# EAGLE design KAnggara75 (EAGLE 9.6.2)
Kiki
DATE: 24/01/2020

## Sheet 1 of 3: ESP32 + PowerS
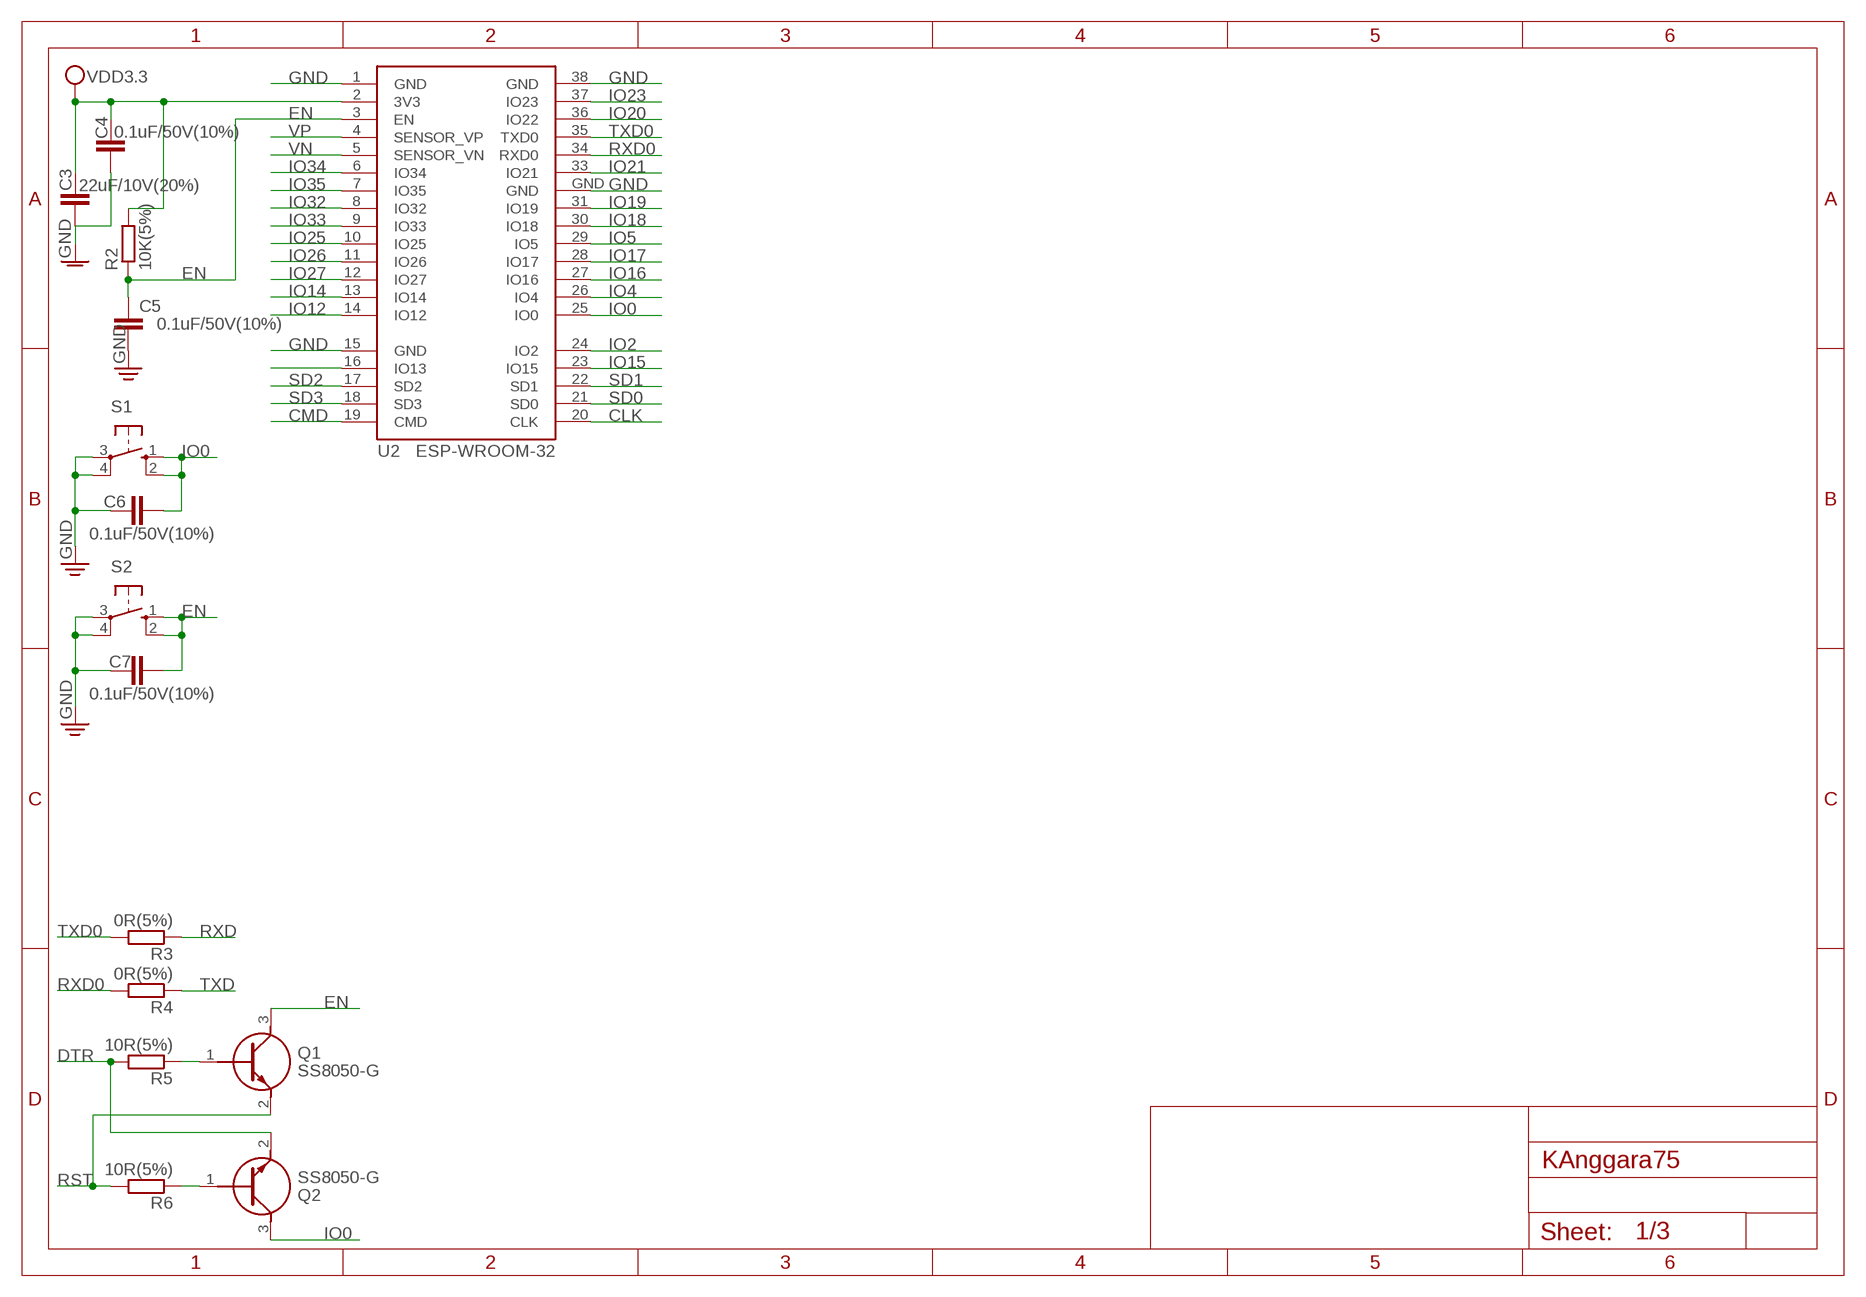
[diagram p0: schematic, sheet 1, part 1 of 2]
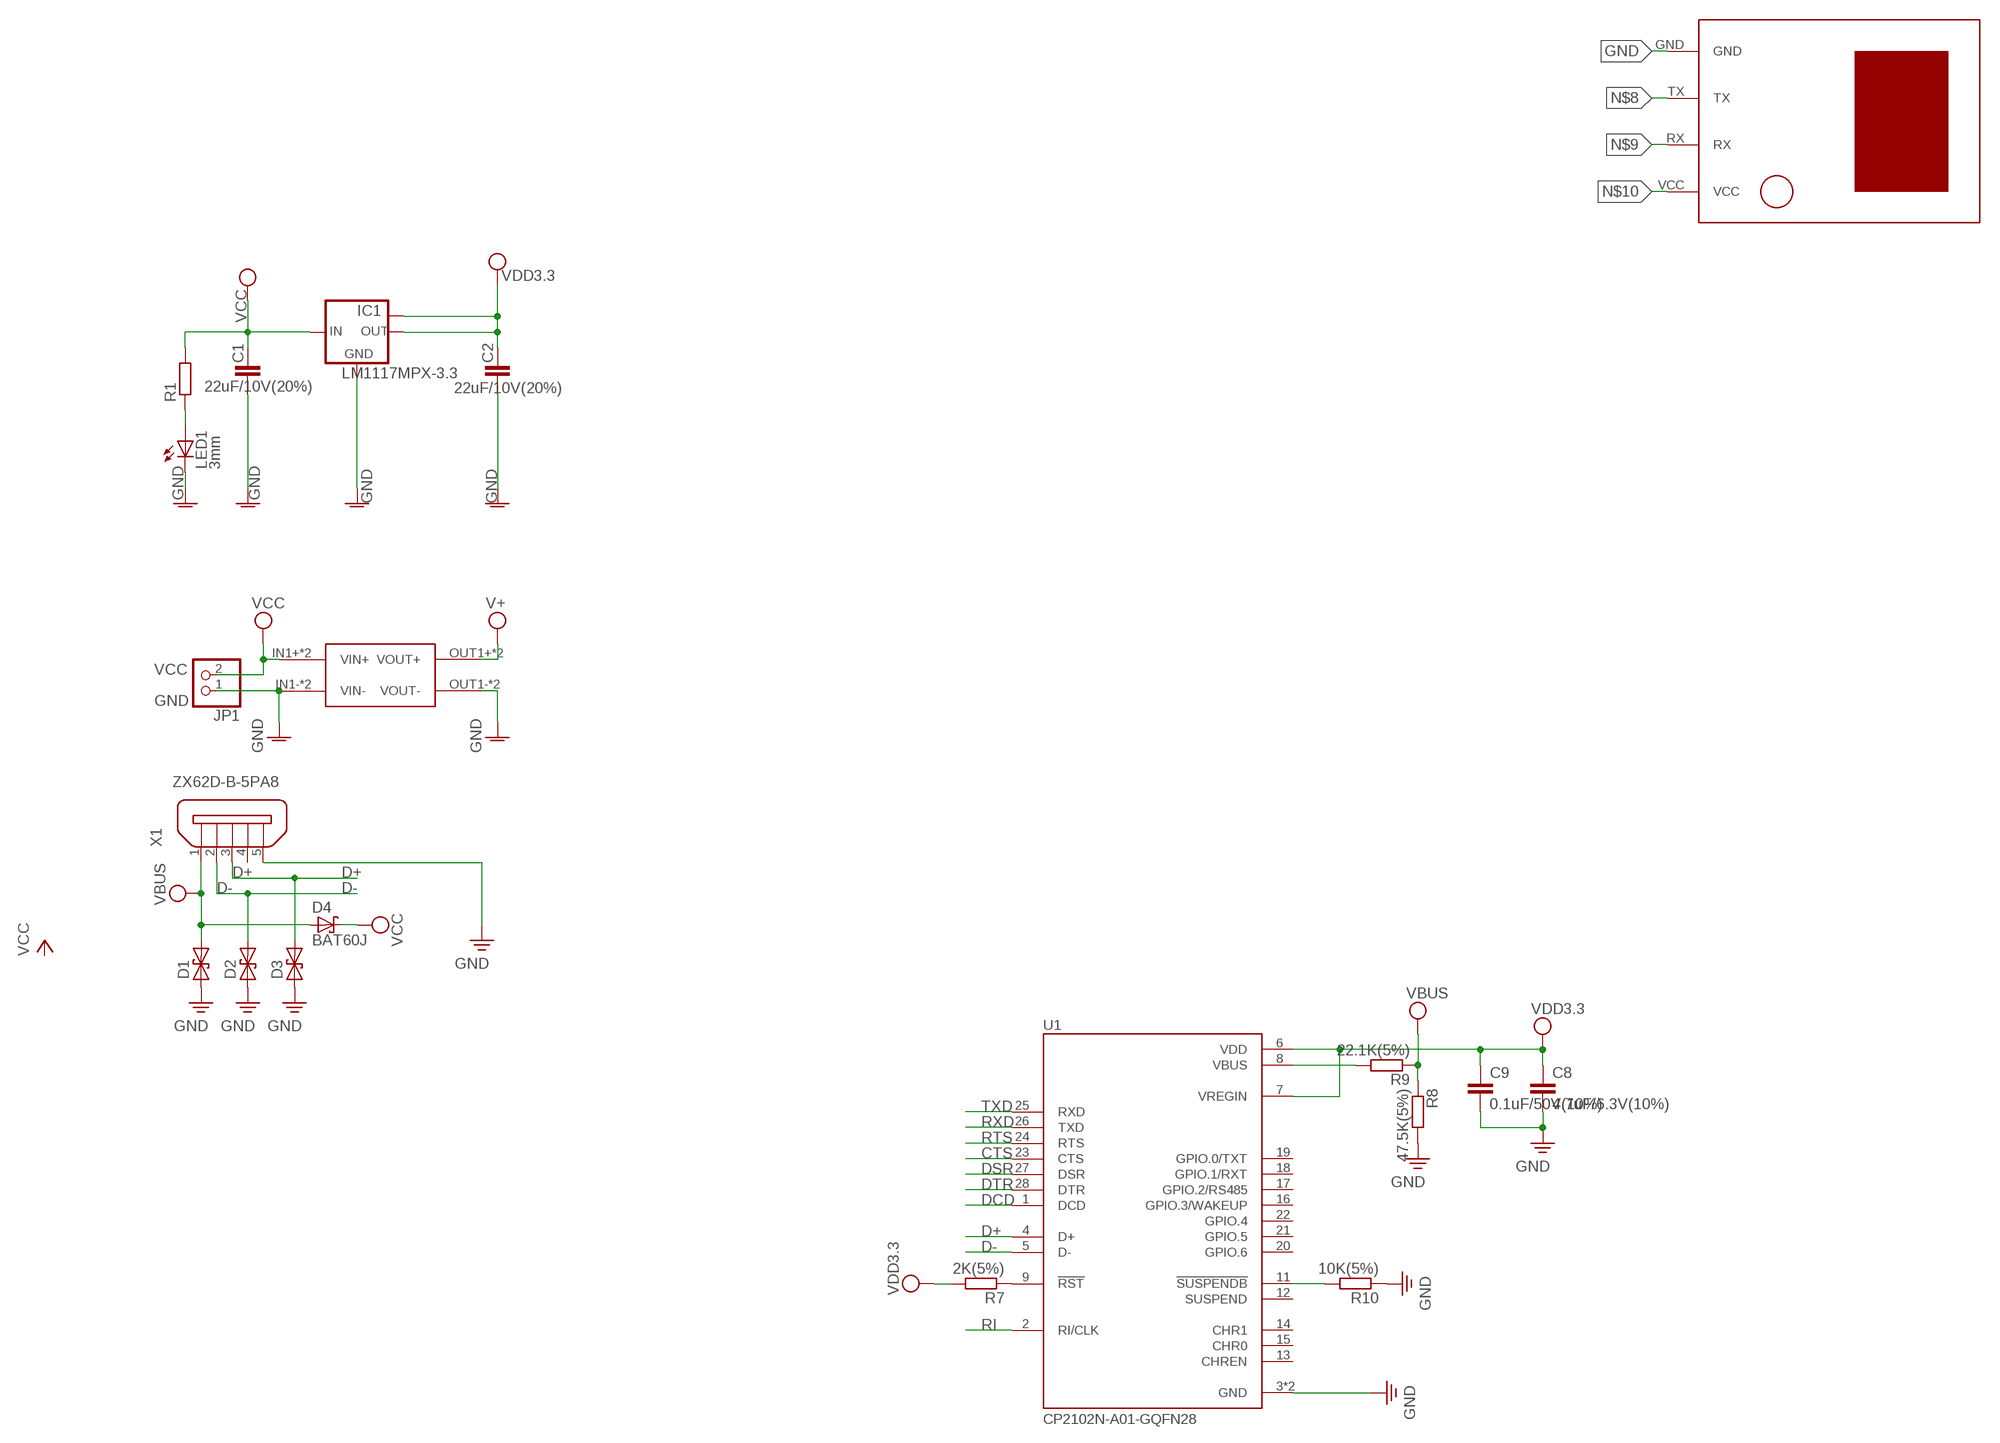
[diagram p1: schematic, sheet 1, part 2 of 2]

### Parts
C1  22uF/10V(20%)  C-EUC1206  [C1206]
C2  22uF/10V(20%)  C-EUC1206  [C1206]
C3  22uF/10V(20%)  C-EUC1206  [C1206]
C4  0.1uF/50V(10%)  C-EUC1206  [C1206]
C5  0.1uF/50V(10%)  C-EUC1206  [C1206]
C6  0.1uF/50V(10%)  C-EUC1206  [C1206]
C7  0.1uF/50V(10%)  C-EUC1206  [C1206]
C8  4.7uF/6.3V(10%)  C-EUC1206  [C1206]
C9  0.1uF/50V(10%)  C-EUC1206  [C1206]
D1  DIODE_SCHOTTKY2-P2-15  [P2-15]
D2  DIODE_SCHOTTKY2-P2-15  [P2-15]
D3  DIODE_SCHOTTKY2-P2-15  [P2-15]
D4  BAT60J  [SOD323_ST]
IC1  LM1117MPX-3.3  [SOT223]
JP1  PINHD-1X2  [1X02]
LED1  3mm  LED3MM  [LED3MM]
Q1  SS8050-G  [SOT95P240X115-3N]
Q2  SS8050-G  [SOT95P240X115-3N]
R1  R-EU_R1210  [R1210]
R2  10K(5%)  R-EU_R1210  [R1210]
R3  0R(5%)  R-EU_R1210  [R1210]
R4  0R(5%)  R-EU_R1210  [R1210]
R5  10R(5%)  R-EU_R1210  [R1210]
R6  10R(5%)  R-EU_R1210  [R1210]
R7  2K(5%)  R-EU_R1210  [R1210]
R8  47.5K(5%)  R-EU_R1210  [R1210]
R9  22.1K(5%)  R-EU_R1210  [R1210]
R10  10K(5%)  R-EU_R1210  [R1210]
S1  10-XX  [B3F-10XX]
S2  10-XX  [B3F-10XX]
U1  CP2102N-A01-GQFN28  [QFN50P500X500X80-29N]
U2  ESP-WROOM-32  [ESP-WROOM-32]
U$1  MP1584  [DC-BRICK]
U$3  U-BLOX-NEO6V2  [U-BLOX-NEO6V2]
X1  ZX62D-B-5PA8  [ZX62D-B-5PA8]

### Nets
CLK: U2.20(CLK)
CMD: U2.19(CMD)
CTS: U1.23(CTS)
D+: D3.C U1.4(D+) X1.3 ; also sheet 2
D-: D2.C U1.5(D-) X1.2 ; also sheet 2
DCD: U1.1(DCD)
DSR: U1.27(DSR)
DTR: Q2.2(E) R5.2 U1.28(DTR)
EN: C5.1 C7.1 Q1.3(C) R2.1 S2.1(S) S2.2(S1) U2.3(EN)
GND: C1.2 C2.2 C3.2 C4.2 IC1.1(GND) JP1.1 LED1.K(C) U2.1(GND) U2.15(GND) U2.38(GND) U2.GND U$1.IN1-(VIN-) U$1.IN2-(VIN-) U$1.OUT1-(VOUT-) U$1.OUT2-(VOUT-) U$3.GND
IO0: C6.1 Q2.3(C) S1.1(S) S1.2(S1) U2.25(IO0)
IO2: U2.24(IO2)
IO4: U2.26(IO4)
IO5: U2.29(IO5)
IO12: U2.14(IO12)
IO14: U2.13(IO14)
IO15: U2.23(IO15)
IO16: U2.27(IO16)
IO17: U2.28(IO17)
IO18: U2.30(IO18)
IO19: U2.31(IO19)
IO20: U2.36(IO22)
IO21: U2.33(IO21)
IO23: U2.37(IO23)
IO25: U2.10(IO25)
IO26: U2.11(IO26)
IO27: U2.12(IO27)
IO32: U2.8(IO32)
IO33: U2.9(IO33)
IO34: U2.6(IO34)
IO35: U2.7(IO35)
N$1: LED1.A R1.1
N$2: R7.1 U1.9(!RST)
N$3: R9.2 U1.8(VBUS)
N$4: Q2.1(B) R6.1
N$5: Q1.1(B) R5.1
N$6: R10.2 U1.11(!SUSPENDB)
N$8: U$3.TX
N$9: U$3.RX
N$10: U$3.VCC
N$14: U2.16(IO13)
PE: C5.2 C6.2 C7.2 C8.2 C9.2 D1.A D2.A D3.A R8.2 R10.1 S1.3(P) S1.4(P1) S2.3(P) S2.4(P1) U1.3(GND) U1.29(GND) X1.5 ; supply symbol labelled GND ; also sheet 2
RI: U1.2(RI/CLK)
RST: Q1.2(E) R6.2
RTS: U1.24(RTS)
RXD: R3.1 U1.26(TXD)
RXD0: R4.2 U2.34(RXD0)
SD0: U2.21(SD0)
SD1: U2.22(SD1)
SD2: U2.17(SD2)
SD3: U2.18(SD3)
TXD: R4.1 U1.25(RXD)
TXD0: R3.2 U2.35(TXD0)
VCC: C1.1 D4.C IC1.3(IN) JP1.2 R1.2 U$1.IN1+(VIN+) U$1.IN2+(VIN+) ; also sheet 2
VDD: C2.1 C3.1 C4.1 C8.1 C9.1 IC1.2(OUT) IC1.TAB(OUT1) R2.2 R7.2 R8.1 R9.1 U1.6(VDD) U1.7(VREGIN) U2.2(3V3) ; supply symbol labelled VDD3.3, VBUS
VEE: D1.C D4.A U$1.OUT1+(VOUT+) U$1.OUT2+(VOUT+) X1.1 ; supply symbol labelled V+, VBUS ; also sheet 2
VN: U2.5(SENSOR_VN)
VP: U2.4(SENSOR_VP)
Unconnected: U1.12(SUSPEND) U1.13(CHREN) U1.14(CHR1) U1.15(CHR0) U1.16(GPIO.3/WAKEUP) U1.17(GPIO.2/RS485) U1.18(GPIO.1/RXT) U1.19(GPIO.0/TXT) U1.20(GPIO.6) U1.21(GPIO.5) U1.22(GPIO.4) X1.4 X1.S1 X1.S2 X1.S3 X1.S4

## Sheet 2 of 3: Power Supply
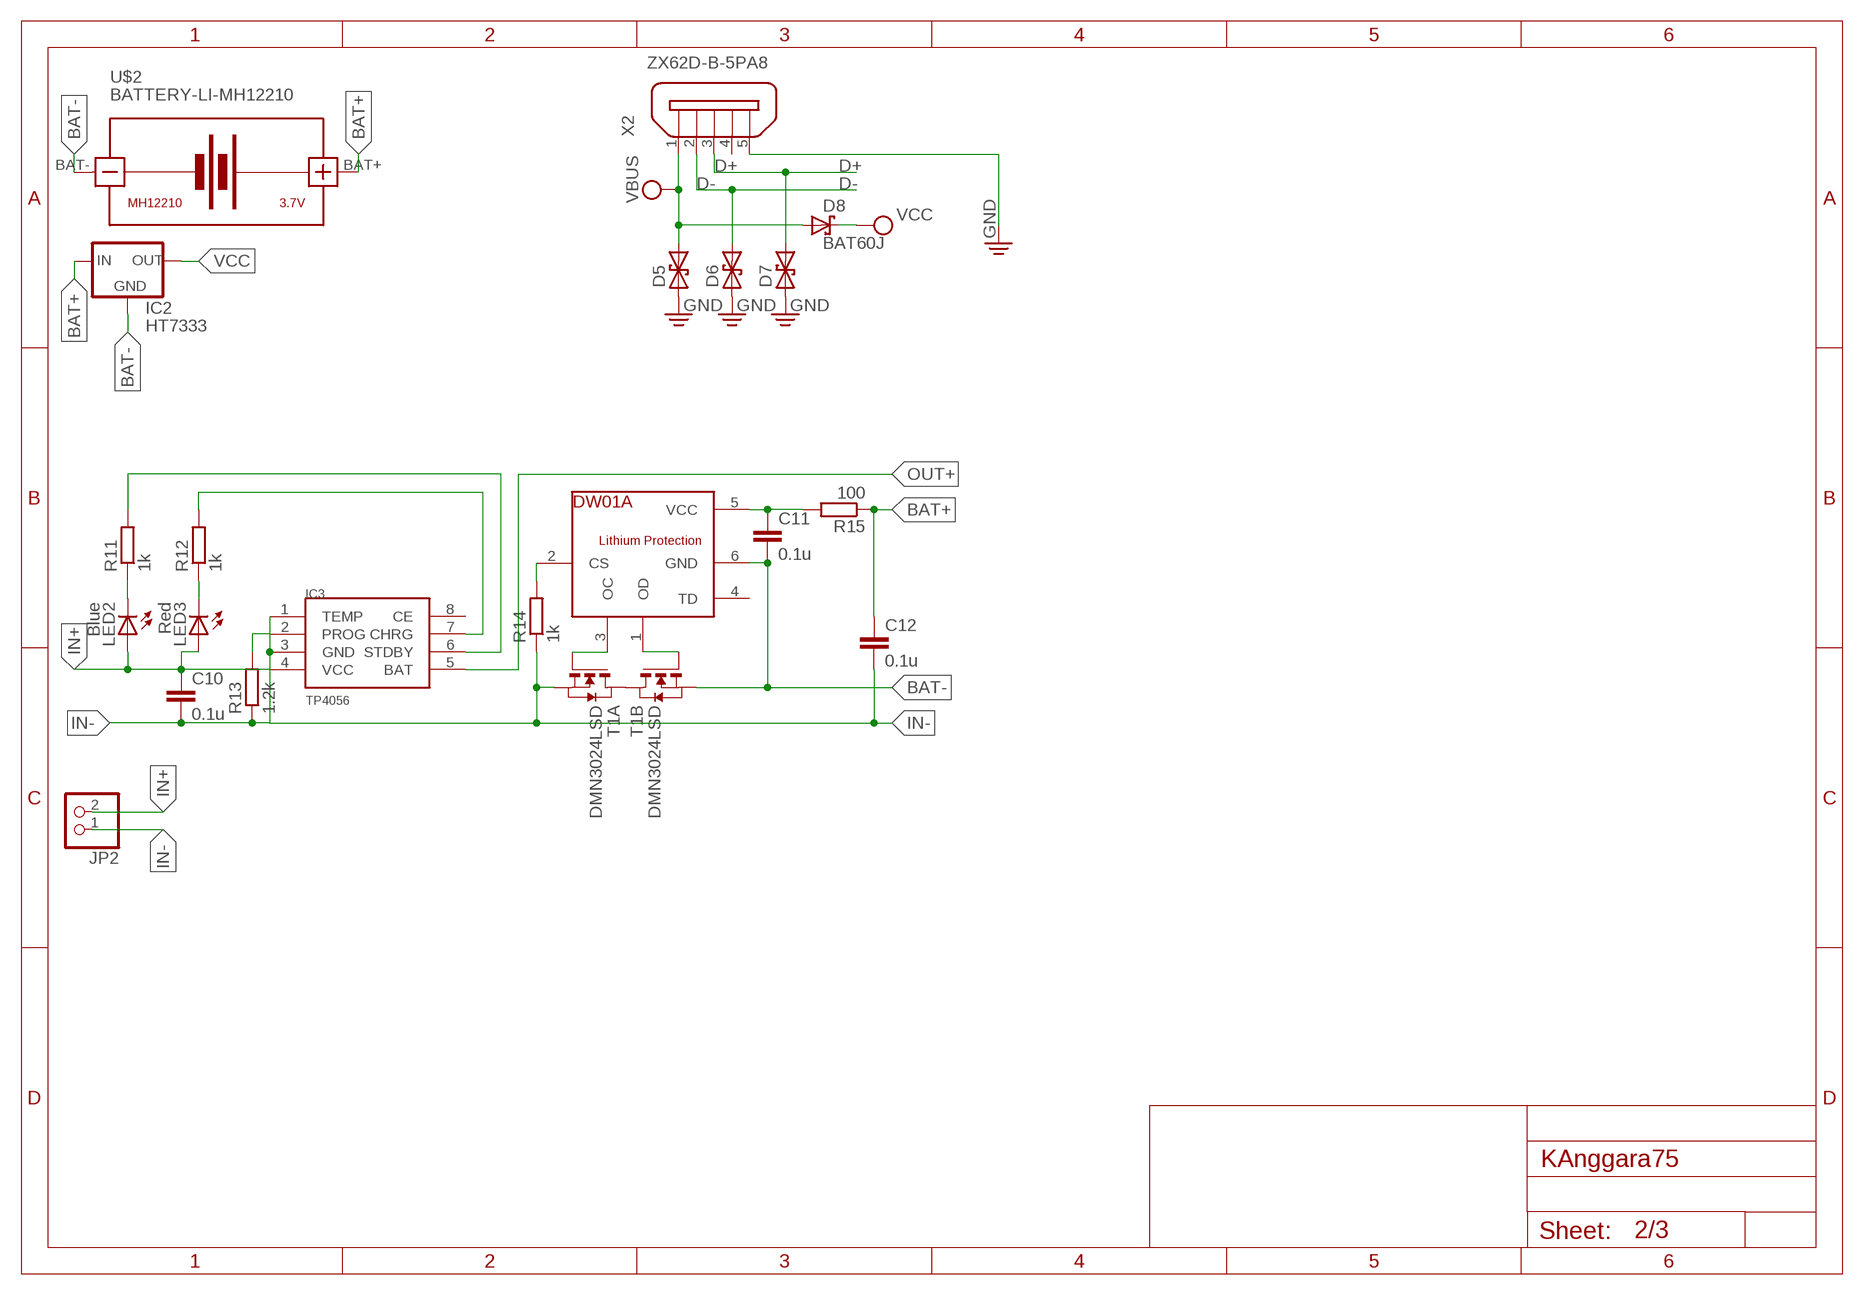
[diagram p2: schematic, sheet 2]

### Parts
C10  0.1u  C-EUC0805  [C0805]
C11  0.1u  C-EUC0805  [C0805]
C12  0.1u  C-EUC0805  [C0805]
D5  DIODE_SCHOTTKY2-P2-15  [P2-15]
D6  DIODE_SCHOTTKY2-P2-15  [P2-15]
D7  DIODE_SCHOTTKY2-P2-15  [P2-15]
D8  BAT60J  [SOD323_ST]
IC2  HT7333  [SOT-89]
IC3  TP4056  [SOP-8]
JP2  PINHD-1X2  [1X02]
LED2  Blue  LEDSMT1206  [1206]
LED3  Red  LEDSMT1206  [1206]
R11  1k  R-EU_R0805  [R0805]
R12  1k  R-EU_R0805  [R0805]
R13  1.2k  R-EU_R0805  [R0805]
R14  1k  R-EU_R0805  [R0805]
R15  100  R-EU_R0805  [R0805]
T1  DMN3024LSD  [TSSOP-8]
U$2  BATTERY-LI-MH12210  [BATTERY-LI-MH12210]
U$5  DW01A  [SOT23-6]
X2  ZX62D-B-5PA8  [ZX62D-B-5PA8]

### Nets
BAT+: C12.1 IC2.3(IN) IC2.4(IN) R15.1 U$2.BAT+
BAT-: C11.2 IC2.2(GND) T1.6(B:S) T1.7(B:S) U$2.BAT- U$5.6(GND)
D+: D7.C X2.3 ; also sheet 1
D-: D6.C X2.2 ; also sheet 1
IN+: C10.1 IC3.4(VCC) JP2.2 LED2.A LED3.A
IN-: C10.2 C12.2 IC3.1(TEMP) IC3.3(GND) JP2.1 R13.1 R14.1 T1.2(A:S) T1.3(A:S)
N$7: LED2.C R11.1
N$11: LED3.C R12.1
N$12: IC3.6(STDBY) R11.2
N$13: IC3.7(CHRG) R12.2
N$15: T1.1(A:D) T1.8(B:D)
N$16: T1.4(A:G) U$5.3(OC)
N$17: T1.5(B:G) U$5.1(OD)
N$18: IC3.2(PROG) R13.2
N$19: R14.2 U$5.2(CS)
N$20: C11.1 R15.2 U$5.5(VCC)
OUT+: IC3.5(BAT)
PE: D5.A D6.A D7.A X2.5 ; supply symbol labelled GND ; also sheet 1
VCC: D8.C IC2.1(OUT) ; also sheet 1
VEE: D5.C D8.A X2.1 ; supply symbol labelled VBUS ; also sheet 1
Unconnected: IC3.8(CE) U$5.4(TD) X2.4 X2.S1 X2.S2 X2.S3 X2.S4

## Sheet 3 of 3: KL

## Library data of the parts
C1-C12 = rcl:C-EU: CAPACITOR, European symbol
D1-D3 D5-D7 = diode:DIODE_SCHOTTKY2-: Schottky Bidirectional Diode
D4 D8 = diode:BAT60J: Schottky barrier diode Source: www.st.com, BAT60J.pdf
IC1 = lm1117:LM1117MPX-*
IC2 = holtek2:HT73*
IC3 = TP4056:TP4056
JP1 JP2 = pinhead:PINHD-1X2: PIN HEADER
LED1-LED3 = led:LED: LED OSRAM: - CHIPLED LG R971, LG N971, LY N971, LG Q971, LY Q971, LO R971, LY R971 LH N974, LH R974 LS Q976, LO Q976, LY Q976 LO Q996 - Hyper CHIPLED LW Q18S LB Q993, LB Q99A, LB R99A - SideLED LS A670, LO A670, LY A670, LG A670, LP A670 LB A673, LV A673, LT A673, LW A673 LH A674 LY A675 LS A676, LA A676, LO A676, LY A676, LW A676 LS A679, LY A679, LG A679 - Hyper Micro SIDELED® LS Y876, LA Y876, LO Y876, LY Y876 LT Y87S - SmartLED LW L88C, LW L88S LB L89C, LB L89S, LG L890 LS L89K, LO L89K, LY L89K LS L896, LA L896, LO L896, LY L896 - TOPLED LS T670, LO T670, LY T670, LG T670, LP T670 LSG T670, LSP T670, LSY T670, LOP T670, LYG T670 LG T671, LOG T671, LSG T671 LB T673, LV T673, LT T673, LW T673 LH T674 LS T676, LA T676, LO T676, LY T676, LB T676, LH T676, LSB T676, LW T676 LB T67C, LV T67C, LT T67C, LS T67K, LO T67K, LY T67K, LW E67C LS E67B, LA E67B, LO E67B, LY E67B, LB E67C, LV E67C, LT E67C LW T67C LS T679, LY T679, LG T679 LS T770, LO T770, LY T770, LG T770, LP T770 LB T773, LV T773, LT T773, LW T773 LH T774 LS E675, LA E675, LY E675, LS T675 LS T776, LA T776, LO T776, LY T776, LB T776 LHGB T686 LT T68C, LB T68C - Hyper Mini TOPLED® LB M676 - Mini TOPLED Santana® LG M470 LS M47K, LO M47K, LY M47K Source: http://www.osram.convergy.de LUXEON: - LUMILED® LXK2-PW12-R00, LXK2-PW12-S00, LXK2-PW14-U00, LXK2-PW14-V00 LXK2-PM12-R00, LXK2-PM12-S00, LXK2-PM14-U00 LXK2-PE12-Q00, LXK2-PE12-R00, LXK2-PE12-S00, LXK2-PE14-T00, LXK2-PE14-U00 LXK2-PB12-K00, LXK2-PB12-L00, LXK2-PB12-M00, LXK2-PB14-N00, LXK2-PB14-P00, LXK2-PB14-Q00 LXK2-PR12-L00, LXK2-PR12-M00, LXK2-PR14-Q00, LXK2-PR14-R00 LXK2-PD12-Q00, LXK2-PD12-R00, LXK2-PD12-S00 LXK2-PH12-R00, LXK2-PH12-S00 LXK2-PL12-P00, LXK2-PL12-Q00, LXK2-PL12-R00 Source: www.luxeon.com KINGBRIGHT: KA-3528ASYC Source: www.kingbright.com
Q1 Q2 = SS8050-G:SS8050-G: Bipolar Transistors - BJT NPN TRANSISTOR 1.5A 40V Source: Datasheet <http://www.comchiptech.com/admin/files/product/SS8050-G RevA181526.pdf>; AVAILABILITY: Unavailable; DESCRIPTION: Bipolar _BJT_ Transistor NPN 25V 1.5A 100MHz 300mW Surface Mount SOT-23; MF: Comchip Technology; MP: SS8050-G; PACKAGE: TO-236 Comchip; PRICE: None
R1-R15 = rcl:R-EU_: RESISTOR, European symbol
S1 S2 = switch-omron:10-XX: OMRON SWITCH; MPN: B3F-1000; OC_FARNELL: 176432; OC_NEWARK: 36M3542
T1 = FS8205A:DMN3024LSD: DUAL N-CHANNEL ENHANCEMENT MODE MOSFET data sheet <http://goo.gl/dRgboR> Dave.Calaway Eagle Library <https://goo.gl/Muy1Tr>
U1 = CP2102N-A01-GQFN28:CP2102N-A01-GQFN28: Ic Bridge Usb To Uart 28qfn; AVAILABILITY: Unavailable; DESCRIPTION: USB Bridge, USB to UART USB 2.0 UART Interface 28-QFN _5x5_; MF: Silicon Labs; MP: CP2102N-A01-GQFN28; PACKAGE: QFN-28 Silicon Labs; PRICE: None
U2 = esp32:ESP-WROOM-32: Espressif Systems ESP-WROOM-32
U$1 = MP1584:MP1584: MP1584-dc-brick-pcb Step down Input: 4.5V - 28V Ouput 0.8V - 25V max. 3A Cheap on ebay
U$2 = diy-modules:BATTERY-LI-MH12210: Lithium-Ion MH12210 Rechargeable Battery Panasonic NCR18650PF battery datasheet available here: https://industrial.panasonic.com/cdbs/www-data/pdf2/ACI4000/ACI4000C12.pdf Click here to find device on ebay.com <http://www.ebay.com/sch/ncr18650b+battery>
U$3 = u-blox neo-6m v2:U-BLOX-NEO6V2
U$5 = DW01A:DW01A
X1 X2 = zx62d-b-5pa8-oshpark_10:ZX62D-B-5PA8: Micro USB Type B Connector - Standard, Shell Through Hole Source: http://www.hirose.co.jp/cataloge_hp/ed_ZX_20140804.pdf; MF: Hirose; MPN: ZX62D-B-5PA8; OC_FARNELL: 2300438; OC_NEWARK: 69W0712

## Board
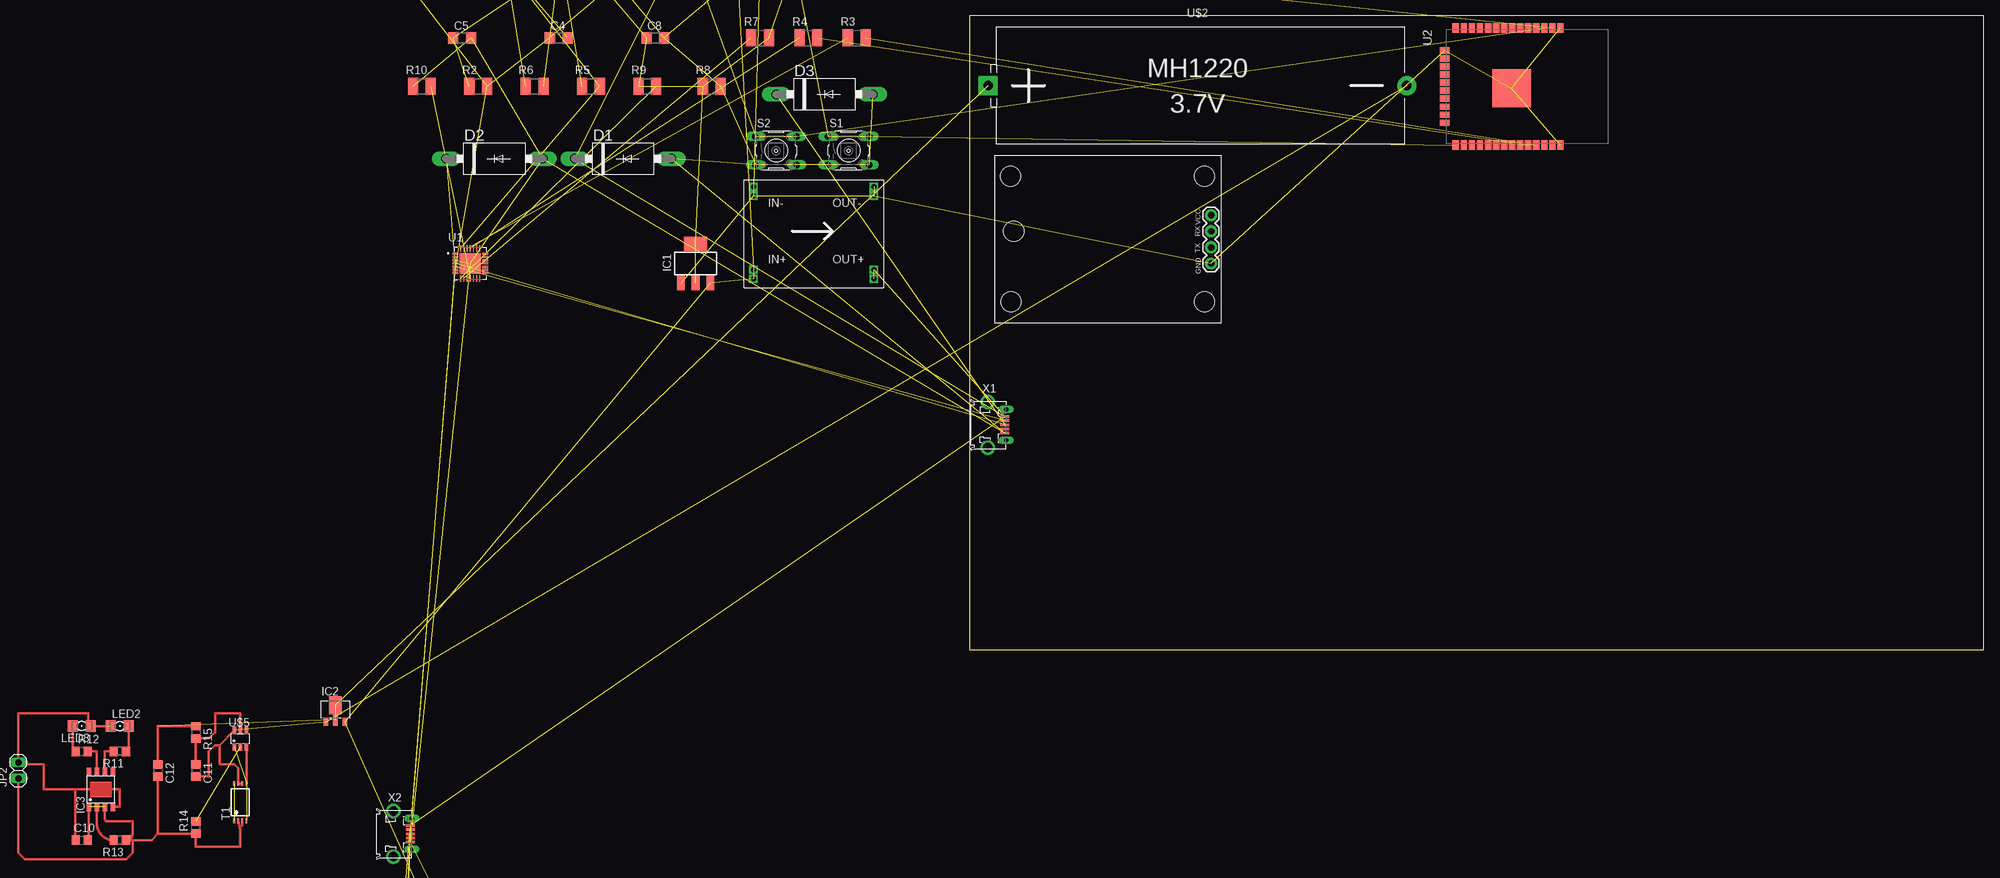
[diagram p3: board, top side]

Size 160 x 100 mm. Coordinates in mm from the lower left corner, seen from the top.
Outline: 0,0 160,0 160,100 0,100 0,0
Copper layers (1*16): Top 0.035mm / dielectric 1.5mm / Bottom 0.035mm
Design rules "default": minimum track width 10mil, minimum drill 24mil, track to track 8mil, track to pad 8mil, pad to pad 8mil, via to via 8mil, smd to smd 8mil, copper to edge 40mil, drill to drill 8mil, minimum pad ring 10mil, minimum via ring 8mil, stop-mask expansion 4mil, vias tented up to drill 0mil, thermal gap 10mil
Holes 3.2 mm at 7,66

### Footprints (pad centres in the part's own frame; a part is rotated, then mirrored left to right if it is on the bottom)
C1206 = smd 1.6 x 1.8: 1 -1.4,0; 2 1.4,0
C0805 = smd 1.3 x 1.5: 1 -0.95,0; 2 0.95,0
P2-15 = drill 1.499 long: A 7.62,0; C -7.62,0
SOD323_ST = smd 0.8 x 0.6: A 1.25,0; C -1.25,0
SOT223 = smd 1.219 x 2.235: 1 -2.311,-3.099; 2 0,-3.099; 3 2.311,-3.099 | smd 3.6 x 2.2: TAB 0,3.099
SOT-89 = smd 0.7 x 1.1: 1 1.5,-2.385; 2 -1.5,-2.385 | smd 0.7 x 1.8: 3 0,-2.035 | smd 2 x 2.8: 4 0,0.265
SOP-8 = smd 1.3 x 0.7: 1 -2.75,1.905; 2 -2.75,0.635; 3 -2.75,-0.635; 4 -2.75,-1.905; 5 2.75,-1.905; 6 2.75,-0.635; 7 2.75,0.635; 8 2.75,1.905
1X02 = drill 1.016 long: 1 -1.27,0; 2 1.27,0
LED3MM = drill 0.813 octagon: A -1.27,0; K 1.27,0
1206 = smd 1.6 x 1.803: A -1.422,0; C 1.422,0
SOT95P240X115-3N = smd 1.1 x 0.6: 1 -1.1,0.95; 2 -1.1,-0.95; 3 1.1,0
R1210 = smd 1.6 x 2.7: 1 -1.4,0; 2 1.4,0
R0805 = smd 1.3 x 1.5: 1 -0.95,0; 2 0.95,0
B3F-10XX = drill 1.016 long: 1 -3.251,2.261; 2 3.251,2.261; 3 -3.251,-2.261; 4 3.251,-2.261
TSSOP-8 = smd 0.3 x 0.75: 1 -0.975,-2.925; 2 -0.325,-2.925; 3 0.325,-2.925; 4 0.975,-2.925; 5 0.975,2.925; 6 0.325,2.925; 7 -0.325,2.925; 8 -0.975,2.925
QFN50P500X500X80-29N = smd 1.01 x 0.27: 1 -2.36,1.5; 2 -2.36,1; 3 -2.36,0.5; 4 -2.36,0; 5 -2.36,-0.5; 6 -2.36,-1; 7 -2.36,-1.5; 15 2.36,-1.5; 16 2.36,-1; 17 2.36,-0.5; 18 2.36,0; 19 2.36,0.5; 20 2.36,1; 21 2.36,1.5 | smd 0.27 x 1.01: 8 -1.5,-2.36; 9 -1,-2.36; 10 -0.5,-2.36; 11 0,-2.36; 12 0.5,-2.36; 13 1,-2.36; 14 1.5,-2.36; 22 1.5,2.36; 23 1,2.36; 24 0.5,2.36; 25 0,2.36; 26 -0.5,2.36; 27 -1,2.36; 28 -1.5,2.36 | smd 3.25 x 3.25: 29 0,0
ESP-WROOM-32 = smd 1.5 x 1: 1 -9.25,7; 2 -9.25,5.73; 3 -9.25,4.46; 4 -9.25,3.19; 5 -9.25,1.92; 6 -9.25,0.65; 7 -9.25,-0.62; 8 -9.25,-1.89; 9 -9.25,-3.16; 10 -9.25,-4.43; 11 -9.25,-5.7; 12 -9.25,-6.97; 13 -9.25,-8.24; 14 -9.25,-9.51; 25 9.25,-9.51; 26 9.25,-8.24; 27 9.25,-6.97; 28 9.25,-5.7; 29 9.25,-4.43; 30 9.25,-3.16; 31 9.25,-1.89; 32 9.25,-0.62; 33 9.25,0.65; 34 9.25,1.92; 35 9.25,3.19; 36 9.25,4.46; 37 9.25,5.73; 38 9.25,7 | smd 1 x 1.5: 15 -5.7,-11.25; 16 -4.43,-11.25; 17 -3.16,-11.25; 18 -1.89,-11.25; 19 -0.62,-11.25; 20 0.65,-11.25; 21 1.92,-11.25; 22 3.19,-11.25; 23 4.46,-11.25; 24 5.73,-11.25 | smd 6 x 6: GND 0.3,-0.7
DC-BRICK = drill 0.8 square: IN1+ 1.5,1.4; IN1- 1.5,14.47; IN2+ 1.5,2.8; IN2- 1.5,15.87; OUT1+ 20.5,1.4; OUT1- 20.5,14.47; OUT2+ 20.5,2.8; OUT2- 20.5,15.87
BATTERY-LI-MH12210 = drill 1.5 pad 3 square: BAT+ -33.02,0 | drill 1.5 pad 3: BAT- 33.02,0
U-BLOX-NEO6V2 = drill 1.016 pad 1.88: GND 17.05,34.13; RX 11.97,34.13; TX 14.51,34.13; VCC 9.43,34.13 | hole 3.2: 3.3,33.1; 23.1,33.1; 3.3,2.5; 23.1,2.6
SOT23-6 = smd 0.55 x 1.2: 1 -0.95,-1.3; 2 0,-1.3; 3 0.95,-1.3; 4 0.95,1.3; 5 0,1.3; 6 -0.95,1.3
ZX62D-B-5PA8 = smd 1.35 x 0.4: 1 4.825,1.3; 2 4.825,0.65; 3 4.825,0; 4 4.825,-0.65; 5 4.825,-1.3 | drill 1.5: S1 2.15,-3.6; S2 2.15,3.6 | drill 0.7 long: S3 5.05,2.425; S4 5.05,-2.425

### Placement (x,y rotation side)
C1  -71.12,104.14 0 top  (outside the outline)
C2  -86.36,104.14 0 top  (outside the outline)
C3  -25.4,110.49 0 top  (outside the outline)
C4  -64.77,96.52 0 top  (outside the outline)
C5  -80.01,96.52 0 top  (outside the outline)
C6  -25.4,104.14 0 top  (outside the outline)
C7  -40.64,104.14 0 top  (outside the outline)
C8  -49.53,96.52 0 top  (outside the outline)
C9  -55.88,104.14 0 top  (outside the outline)
C10  -140,-30 0 top  (outside the outline)
C11  -122,-19 270 top  (outside the outline)
C12  -128,-19 270 top  (outside the outline)
D1  -54.61,77.47 0 top  (outside the outline)
D2  -74.93,77.47 0 top  (outside the outline)
D3  -22.86,87.63 0 top  (outside the outline)
D4  -46.99,110.49 0 top  (outside the outline)
D5  -83,-56 0 top  (outside the outline)
D6  -83,-79 0 top  (outside the outline)
D7  -83,-102 0 top  (outside the outline)
D8  -61,-93 0 top  (outside the outline)
IC1  -43.18,60.96 0 top  (outside the outline)
IC2  -100,-9 0 top  (outside the outline)
IC3  -137,-22 90 top  (outside the outline)
JP1  -31.75,109.22 0 top  (outside the outline)
JP2  -150,-19 90 top  (outside the outline)
LED1  -55.88,110.49 0 top  (outside the outline)
LED2  -134,-12 0 top  (outside the outline)
LED3  -140,-12 180 top  (outside the outline)
Q1  -63.5,109.22 0 top  (outside the outline)
Q2  -72.39,109.22 0 top  (outside the outline)
R1  -38.1,109.22 0 top  (outside the outline)
R2  -77.47,88.9 0 top  (outside the outline)
R3  -17.78,96.52 0 top  (outside the outline)
R4  -25.4,96.52 0 top  (outside the outline)
R5  -59.69,88.9 0 top  (outside the outline)
R6  -68.58,88.9 0 top  (outside the outline)
R7  -33.02,96.52 0 top  (outside the outline)
R8  -40.64,88.9 0 top  (outside the outline)
R9  -50.8,88.9 0 top  (outside the outline)
R10  -86.36,88.9 0 top  (outside the outline)
R11  -134,-16 180 top  (outside the outline)
R12  -140,-16 0 top  (outside the outline)
R13  -134,-30 180 top  (outside the outline)
R14  -122,-28 90 top  (outside the outline)
R15  -122,-13 270 top  (outside the outline)
S1  -19.05,78.74 0 top  (outside the outline)
S2  -30.48,78.74 0 top  (outside the outline)
T1  -115,-24 0 top  (outside the outline)
U1  -78.74,60.96 0 top  (outside the outline)
U2  86.24,88.86 270 top
U$1  -35.56,57.15 0 top  (outside the outline)
U$2  36,89 0 top
U$3  4,78 270 top
U$5  -115,-14 0 top  (outside the outline)
X1  0.77,35.5 0 top
X2  -93,-29 0 top  (outside the outline)

### Tracks (layer width: path | path; a pad name or v marks a point on that pad's centre or on a via)
BAT+  (3 unrouted)
  Top 0.406: R15.1 -128,-12.05 | -128,-12.05 -128,-12 | -128,-12.05 C12.1
BAT-  (2 unrouted)
  Top 0.406: C11.2 -120.05,-19.95 -120,-20 -120,-16 -119,-15 -118.25,-15 | -118.25,-15 U$5.6 | T1.6 T1.7 -115.33,-18.68 -116,-18 -118.25,-18 -118.25,-15
D+  (4 unrouted)
D-  (4 unrouted)
DTR  (2 unrouted)
EN  (6 unrouted)
GND  (15 unrouted)
IN+  (1 unrouted)
  Top 0.406: -136,-12 LED3.A -139,-12 -139,-10 -150,-10 JP2.2 -150,-18 -146,-18 -146,-22 -141,-22 | IC3.4 -134,-24.75 -134,-22 -141,-22 | C10.1 -141,-30 -141,-22
IN-  (1 unrouted)
  Top 0.406: C10.2 -138.91,-30 IC3.1 | R13.1 arc90 -132,-28.95 | -132,-28.95 -132,-27 -136,-27 arc-90 -136.37,-26.64 IC3.3 | -132,-28.95 -132,-29 -133,-30 -132,-30 | -132,-30 -129,-30 -128,-29 | -128,-29 C12.2 | JP2.1 -150,-32 -149,-33 -133,-33 -132,-32 -132,-30 | -128,-29 -127.95,-28.95 R14.1 -122,-31 -115,-31 -115,-28.25 -115.06,-28.01 | -115.06,-28.01 T1.2 | T1.3 -114.67,-27.63 -115.06,-28.01
IO0  (4 unrouted)
N$1  (1 unrouted)
N$2  (1 unrouted)
N$3  (1 unrouted)
N$4  (1 unrouted)
N$5  (1 unrouted)
N$6  (1 unrouted)
N$7
  Top 0.406: R11.1 -132.58,-16 LED2.C
N$11
  Top 0.406: R12.1 -141.42,-16 LED3.C
N$12
  Top 0.406: R11.2 -136.37,-16 IC3.6
N$13
  Top 0.406: R12.2 -137.63,-16 IC3.7
N$15  (1 unrouted)
N$16  (1 unrouted)
  Top 0.406: U$5.3 -114,-15.3 -114,-21
N$17  (1 unrouted)
N$18
  Top 0.406: R13.2 arc-90 -137.63,-27.32 IC3.2
N$19  (1 unrouted)
N$20  (1 unrouted)
  Top 0.406: C11.1 -122,-14 | R15.2 -119.95,-13.95 -119,-13 -119,-10 -115,-10 U$5.5
PE  (20 unrouted)
RST  (1 unrouted)
RXD  (1 unrouted)
RXD0  (1 unrouted)
TXD  (1 unrouted)
TXD0  (1 unrouted)
VCC  (8 unrouted)
VDD  (13 unrouted)
VEE  (7 unrouted)